# Altium schematic sheet mboard_mcu (2).SchDoc: =GlobalProjectName
size 410 x 297 mm; SheetNumber: 2; SheetTotal: 2; PageSetup: Record=PageOptions|CenterHorizontal=True|CenterVertical=True|PrintScale=1.00|XCorrection=1.00|YCorrection=1.00|PrintKind=1|BorderSize=5000000|LeftOffset=0|BottomOffset=0|Orientation=2|PaperLength=1000|PaperWidth=1000|Scale=100|PaperSource=15|PrintQuality=1200|MediaType=1|DitherType=10|PaperKind=A3|PrintScaleMode=1; Weight: -; ScaleFactor: -
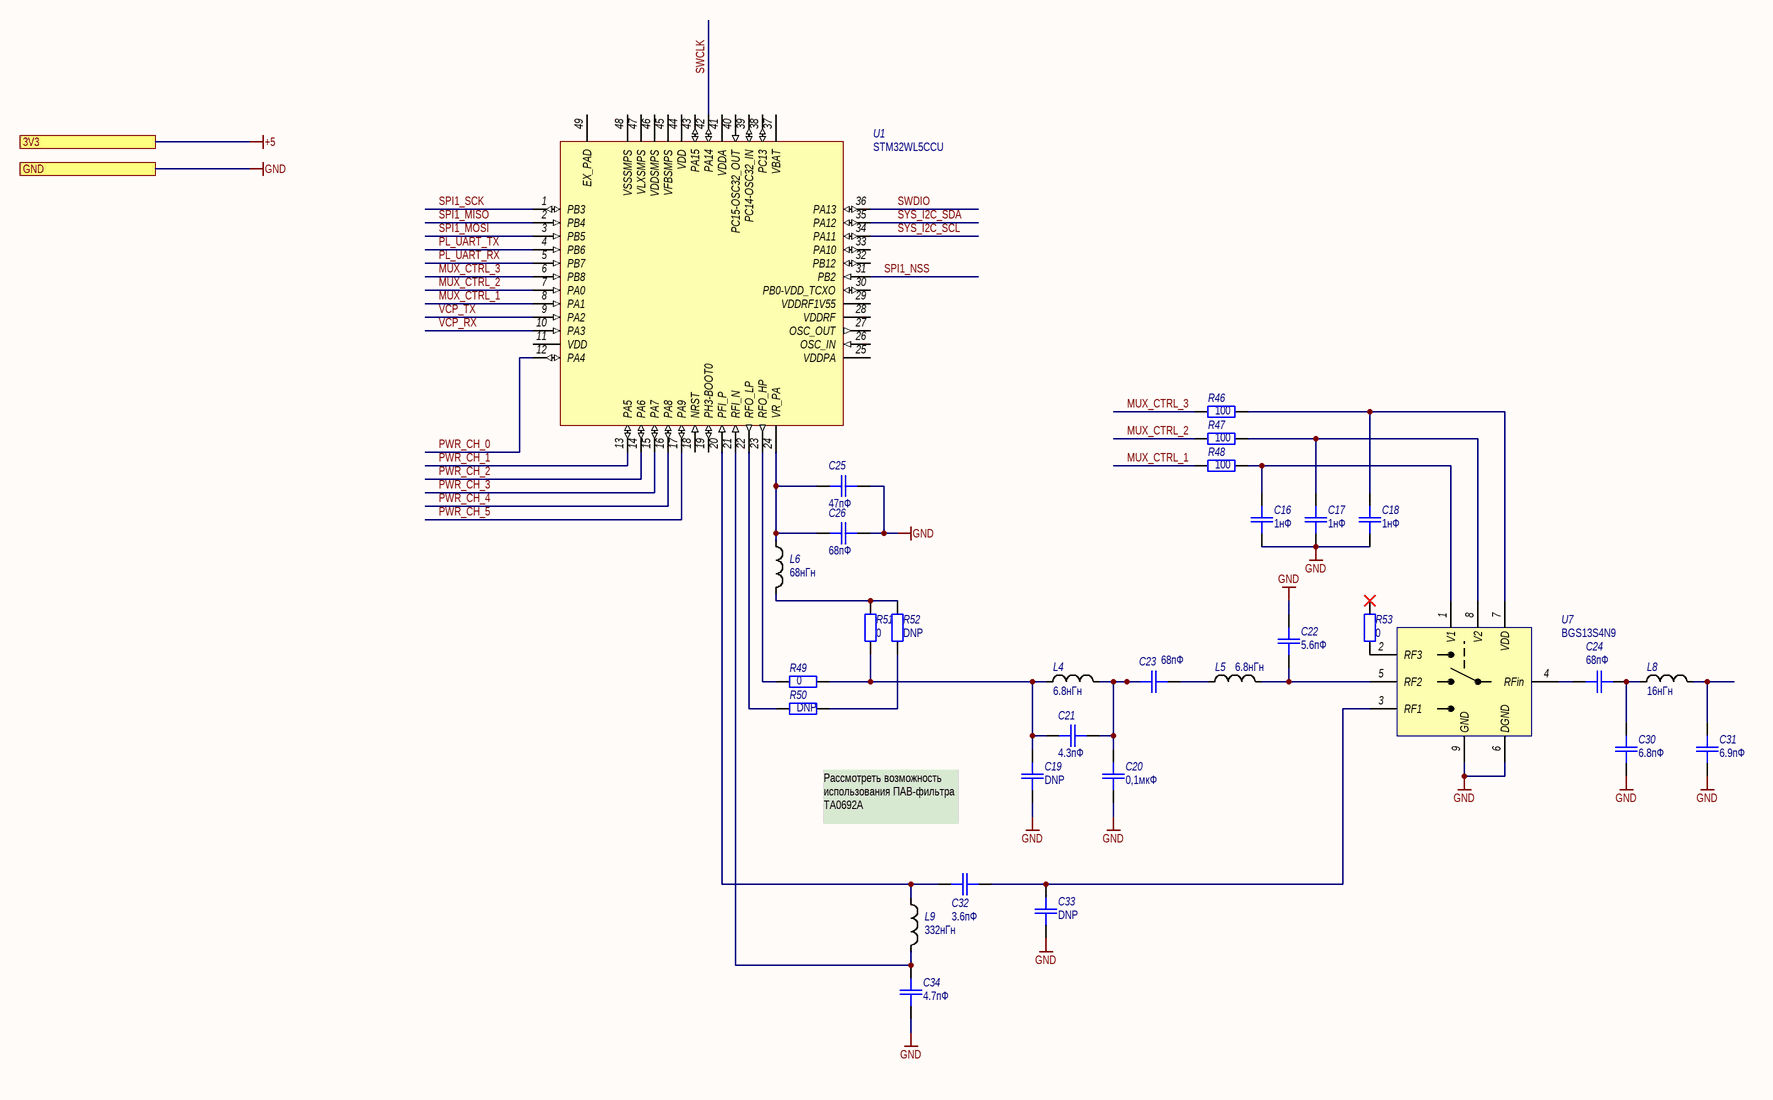
[diagram p0: mboard_mcu (2).SchDoc]

## Parts
C16  value 1нФ  [SMD_C0402]  (hidden comment: K10-79)
C17  value 1нФ  [SMD_C0402]  (hidden comment: K10-79)
C18  value 1нФ  [SMD_C0402]  (hidden comment: K10-79)
C19  value DNP  [SMD_C0402]  (hidden comment: K10-79)
C20  value 0,1мкФ  [SMD_C0402]  (hidden comment: K10-79)
C21  value 4.3пФ  [SMD_C0402]  (hidden comment: K10-79)
C22  value 5.6пФ  [SMD_C0402]  (hidden comment: K10-79)
C23  value 68пФ  [SMD_C0603]  (hidden comment: K10-79)
C24  value 68пФ  [SMD_C0402]  (hidden comment: K10-79)
C25  value 47пФ  [SMD_C0402]  (hidden comment: K10-79)
C26  value 68пФ  [SMD_C0402]  (hidden comment: K10-79)
C30  value 6.8пФ  [SMD_C0402]  (hidden comment: K10-79)
C31  value 6.9пФ  [SMD_C0402]  (hidden comment: K10-79)
C32  value 3.6пФ  [SMD_C0603]  (hidden comment: K10-79)
C33  value DNP  [SMD_C0603]  (hidden comment: K10-79)
C34  value 4.7пФ  [SMD_C0603]  (hidden comment: K10-79)
L4  value 6.8нГн  [SMD_0805]  (hidden comment: Inductor)
L5  value 6.8нГн  [SMD_0805]  (hidden comment: Inductor)
L6  value 68нГн  [SMD_0805]  (hidden comment: Inductor)
L8  value 16нГн  [SMD_0805]  (hidden comment: Inductor)
L9  value 332нГн  [SMD_0805]  (hidden comment: Inductor)
R46  value 100  [SMD_0805]  (hidden comment: OSM R1-12)
R47  value 100  [SMD_0805]  (hidden comment: OSM R1-12)
R48  value 100  [SMD_0805]  (hidden comment: OSM R1-12)
R49  value 0  [SMD_0805]  (hidden comment: OSM R1-12)
R50  value DNP  [SMD_0805]  (hidden comment: OSM R1-12)
R51  value 0  [SMD_0805]  (hidden comment: OSM R1-12)
R52  value DNP  [SMD_0805]  (hidden comment: OSM R1-12)
R53  value 0  [SMD_0805]  (hidden comment: OSM R1-12)
U1  STM32WL5CCU  [UQFNPN48]
U7  BGS13S4N9  [TSNP-9-3]

## Ports
3V3, GND

## Nets
+5: port 3V3
GND: C16.1 C17.1 C18.1 C19.2 C20.2 C22.2 C25.2 C26.2 C30.1 C31.1 C33.1 C34.2 U7.6(DGND) U7.9(GND) ; port GND
MUX_CTRL_1: R48.1 U1.8(PA1)
MUX_CTRL_2: R47.1 U1.7(PA0)
MUX_CTRL_3: R46.1 U1.6(PB8)
PL_UART_RX: U1.5(PB7)
PL_UART_TX: U1.4(PB6)
PWR_CH_0: U1.12(PA4)
PWR_CH_1: U1.13(PA5)
PWR_CH_2: U1.14(PA6)
PWR_CH_3: U1.15(PA7)
PWR_CH_4: U1.16(PA8)
PWR_CH_5: U1.17(PA9)
SPI1_MISO: U1.2(PB4)
SPI1_MOSI: U1.3(PB5)
SPI1_NSS: U1.31(PB2)
SPI1_SCK: U1.1(PB3)
SWCLK: U1.42(PA14)
SWDIO: U1.36(PA13)
SYS_I2C_SCL: U1.34(PA11)
SYS_I2C_SDA: U1.35(PA12)
VCP_RX: U1.10(PA3)
VCP_TX: U1.9(PA2)
NetC16_2: C16.2 R48.2 U7.1(V1)
NetC17_2: C17.2 R47.2 U7.8(V2)
NetC18_2: C18.2 R46.2 U7.7(VDD)
NetC19_1: C19.1 C21.1 L4.2 R49.2 R51.1
NetC20_1: C20.1 C21.2 C23.1 L4.1
NetC22_1: C22.1 L5.2 U7.5(RF2)
NetC23_2: C23.2 L5.1
NetC24_1: C24.1 U7.4(RFin)
NetC24_2: C24.2 C30.2 L8.1
NetC25_1: C25.1 C26.1 L6.1 U1.24(VR_PA)
NetC31_2: C31.2 L8.2
NetC32_1: C32.1 L9.1 U1.20(PFI_P)
NetC32_2: C32.2 C33.2 U7.3(RF1)
NetC34_1: C34.1 L9.2 U1.21(RFI_N)
NetL6_2: L6.2 R51.2 R52.2
NetR49_1: R49.1 U1.23(RFO_HP)
NetR50_1: R50.1 U1.22(RFO_LP)
NetR50_2: R50.2 R52.1
NetR53_2: R53.2 U7.2(RF3)

Not connected (* = marked no-connect by the designer): R53 1*; U1 11(VDD) 18(NRST) 19(PH3-BOOT0) 25(VDDPA) 26(OSC_IN) 27(OSC_OUT) 28(VDDRF) 29(VDDRF1V55) 30(PB0-VDD_TCXO) 32(PB12) 33(PA10) 37(VBAT) 38(PC13) 39(PC14-OSC32_IN) 40(PC15-OSC32_OUT) 41(VDDA) 43(PA15) 44(VDD) 45(VFBSMPS) 46(VDDSMPS) 47(VLXSMPS) 48(VSSSMPS) 49(EX_PAD)

## Notes on the sheet
- Рассмотреть возможность использования ПАВ-фильтра TA0692A
- Подп. и дата
- Инв. № дубл.
- Взам. инв. №
- Инв. № подл.
- Изм.
- Лист
- № докум.
- Подп.
- Дата
- Форма 2а ГОСТ 2.104-2006
- Копировал
- Формат А3

## Library data of the parts
C16-C26 C30-C34 = Capacitor: Назначение: SMD-конденсатор; Наименование: К10-79; Потребление, Вт: 0; Точность: %; Напряжение: В; Диэлектрик: *
L4-L6 L8 L9 = Inductor: Наименование: Индуктивность; Назначение: SMD-индуктивность; Потребление, Вт: 0,010
R46-R53 = Resistor: Наименование: ОСМ Р1-12; Назначение: SMD-резистор; Потребление, Вт: 0,001; Точность: %
U1 = STM32WL5CCU: Multiprotocol Wireless 32-bit MCU with LPWAN Sub-GHz radio solution; Потребление, Вт: 0.3; ComponentLink1Description: Datasheet; ComponentLink1URL: https://www.st.com/resource/en/datasheet/stm32wle5c8.pdf; Назначение: Multiprotocol Wireless 32-bit MCU with LPWAN Sub-GHz radio solution; Наименование: STM32WL5CCU
U7 = BGS13S4N9: Wideband RF SP3T Switch; Internal_Part_Number: MCD-02018; Part_Type: IC; Manufacturer: INFINEON; ECCN_US: EAR99; ECCN_EU: tbd; Provided_By: SUBCO; Потребление, Вт: 0.001; Status: Checked; Manufacturer_Part_Number: BGS13S4N9; Package: TSNP-9-3; ComponentLink1Description: Datasheet; ComponentLink1URL: http://tunmcdsvn.tun.st.com/Component_Datasheet_Library/Trunk/IC/Infineon_SP3T_BGS13S4N9/Infineon-BGS13S4N9-DS-v01_00-EN.pdf; Value: BGS13S4N9; Назначение: Wideband RF SP3T Switch; Наименование: BGS13S4N9